# Altium schematic sheet Oxygen-Analyzer.SchDoc
size A3
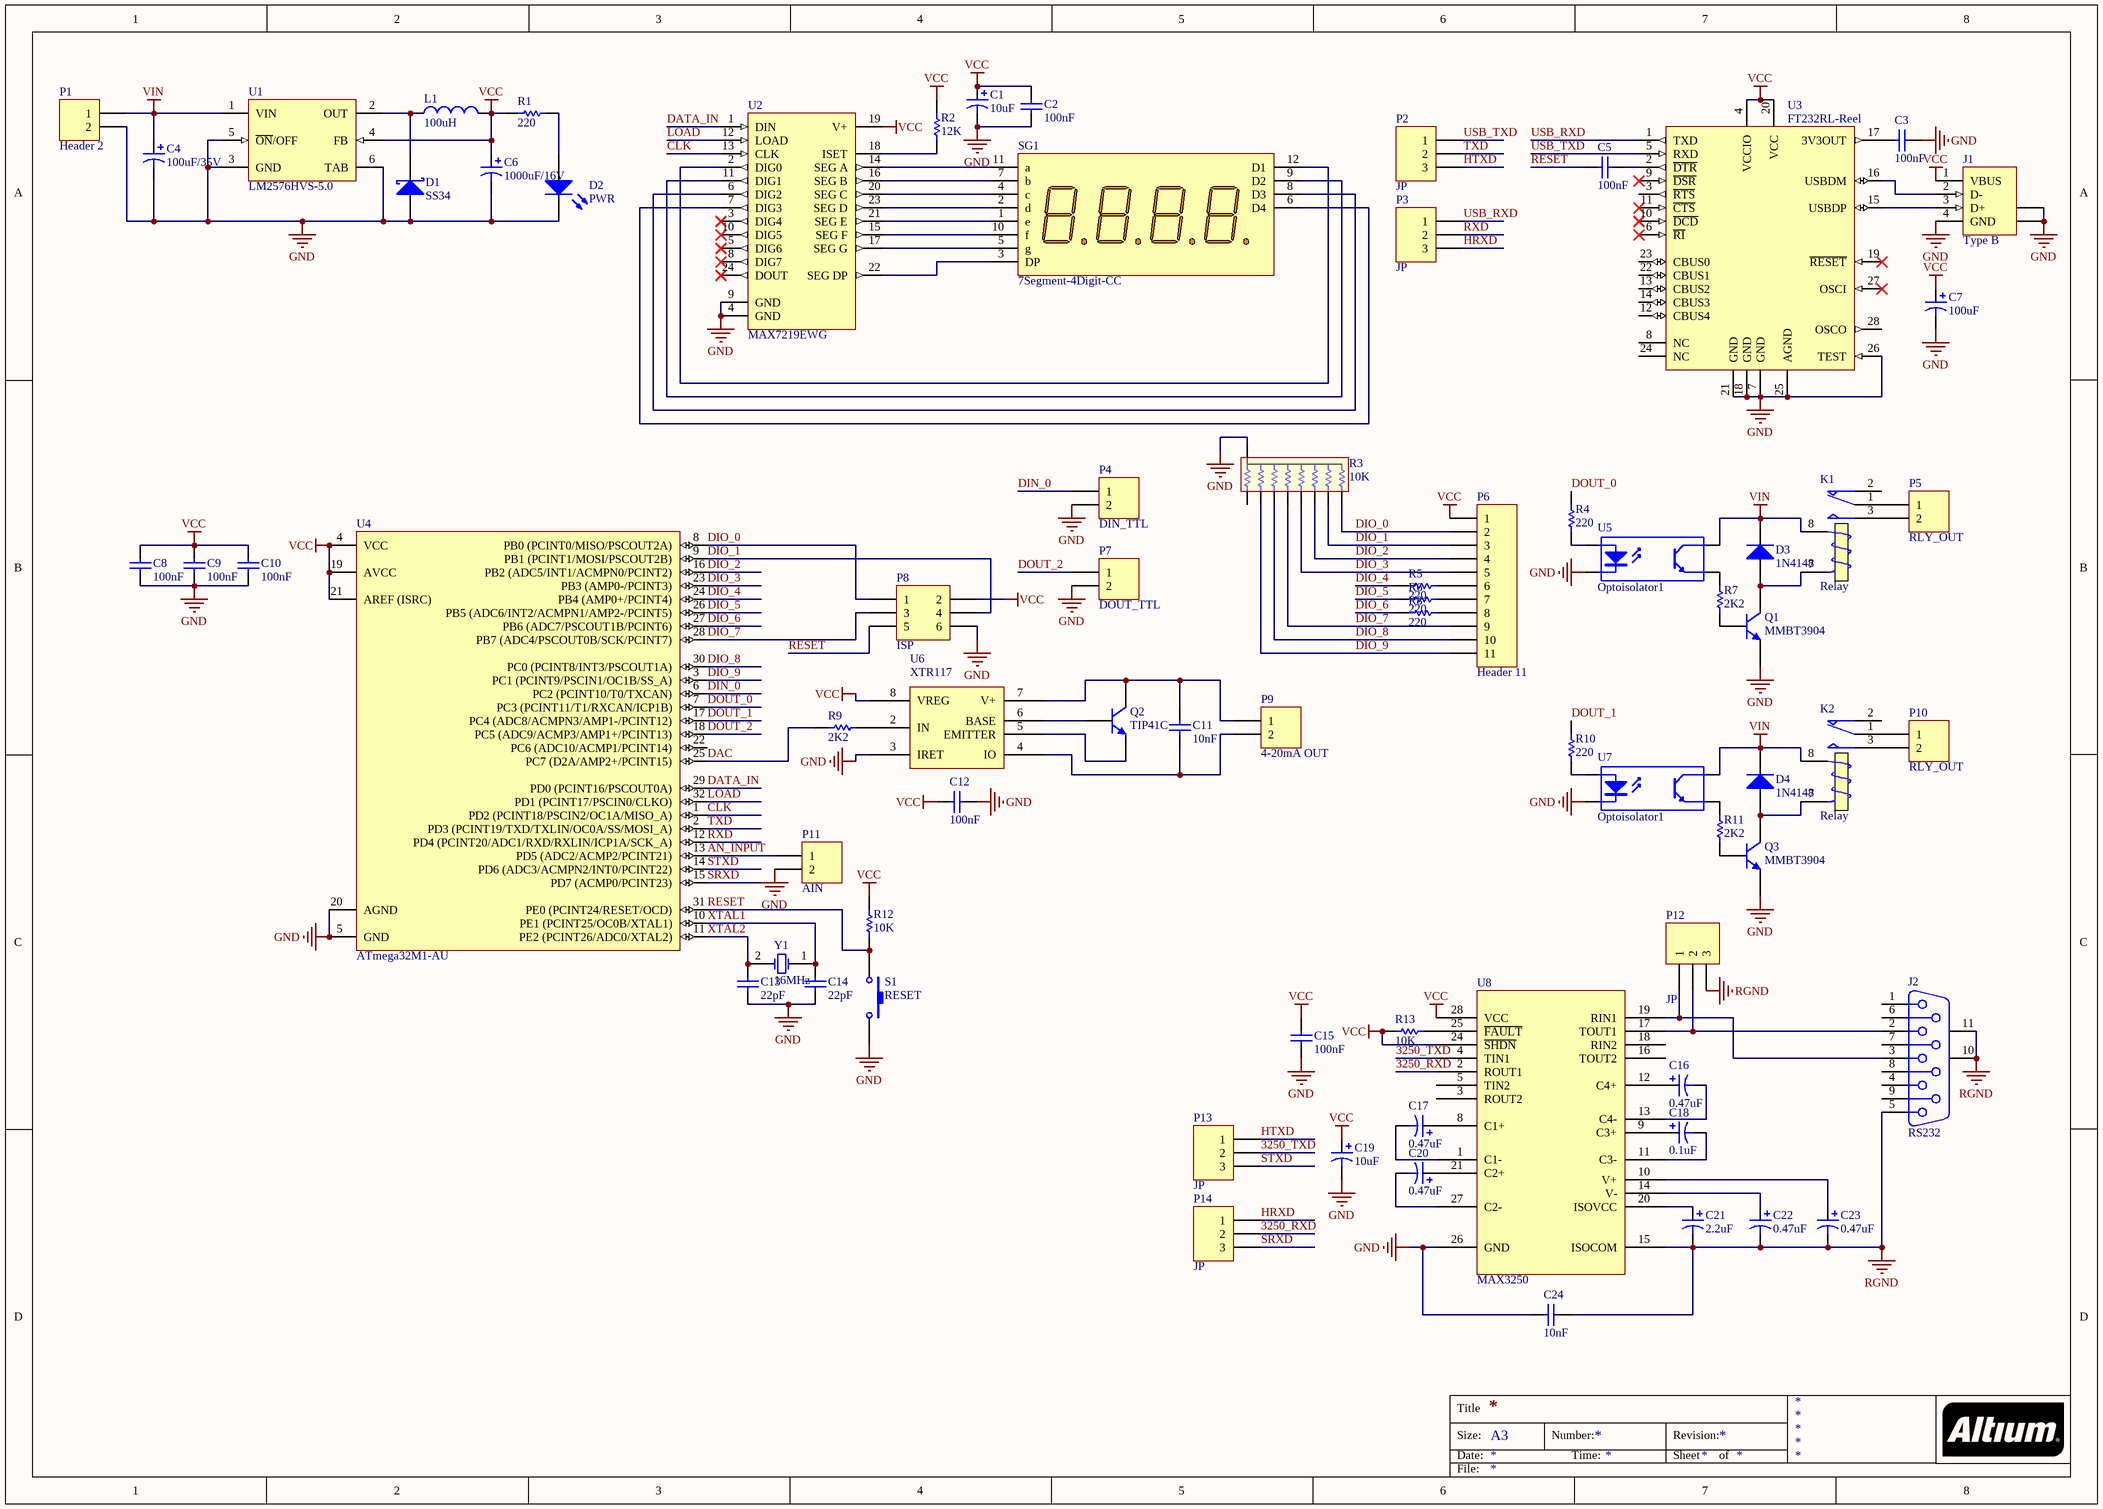
[diagram p0: Oxygen-Analyzer.SchDoc]

## Parts
C1  10uF  [CT3216]
C2  100nF  [C0805]
C3  100nF  [C0805]
C4  100uF/35V  [SMD_ELCO_6MM]
C5  100nF  [C0805]
C6  1000uF/16V  [SMD_ELCO_10MM]
C7  100uF  [CT7343]
C8  100nF  [C0805]
C9  100nF  [C0805]
C10  100nF  [C0805]
C11  10nF  [C0805]
C12  100nF  [C0805]
C13  22pF  [C0805]
C14  22pF  [C0805]
C15  100nF  [C0805]
C16  0.47uF  [CT3216]
C17  0.47uF  [CT3216]
C18  0.1uF  [CT3216]
C19  10uF  [CT3216]
C20  0.47uF  [CT3216]
C21  2.2uF  [CT3216]
C22  0.47uF  [CT3216]
C23  0.47uF  [CT3216]
C24  10nF  [C0805]
D1  SS34  [SMC]
D2  PWR  [CHIPLED_1206]
D3  1N4148  [SOD80C]
D4  1N4148  [SOD80C]
J1  Type B  [USB-B-PTH]
J2  RS232  [DB9_MALE]
K1  Relay  [351]
K2  Relay  [351]
L1  100uH  [DR73]
P1  Header 2  [W237-132]
P2  JP  [HDR1X3]
P3  JP  [HDR1X3]
P4  DIN_TTL  [W237-132]
P5  RLY_OUT  [W237-132]
P6  Header 11  [HDR1X11]
P7  DOUT_TTL  [W237-132]
P8  ISP  [HDR2X3]
P9  4-20mA OUT  [W237-132]
P10  RLY_OUT  [W237-132]
P11  AIN  [W237-132]
P12  JP  [HDR1X3]
P13  JP  [HDR1X3]
P14  JP  [HDR1X3]
Q1  MMBT3904  [SOT23_N]
Q2  TIP41C  [TO220H]
Q3  MMBT3904  [SOT23_N]
R1  220  [R0805]
R2  12K  [R0805]
R3  10K  [SIL9]
R4  220  [R0805]
R5  220  [R0805]
R6  220  [R0805]
R7  2K2  [R0805]
R8  220  [R0805]
R9  2K2  [R0805]
R10  220  [R0805]
R11  2K2  [R0805]
R12  10K  [R0805]
R13  10K  [R0805]
S1  RESET  [TACTILE-SWITCH-1101NE]
SG1  7Segment-4Digit-CC  [7Segment-4Digit-CC]
U1  LM2576HVS-5.0  [TS5B_N]
U2  MAX7219EWG  [WSO24_N]
U3  FT232RL-Reel  [SSOP-28_N]
U4  ATmega32M1-AU  [32A_N]
U5  Optoisolator1  [DIP-4]
U6  XTR117  [MSOP8]
U7  Optoisolator1  [DIP-4]
U8  MAX3250  [SSOP-28]
Y1  16MHz  [HC49US]

## Nets
GND: C1.2 C2.1 C3.1 C4.2 C6.2 C7.2 C8.1 C9.1 C10.1 C12.1 C13.1 C14.1 C15.1 C19.2 C24.2 D1.1(A) D2.2(K) J1.4(GND) J1.5(SHLD) J1.6(SHLD) P1.2 P4.2 P7.2 P8.6 P11.2 Q1.2(E) Q3.2(E) R3.1 S1.2 U1.3(GND) U1.5(~{ON}/OFF) U1.6(TAB) U2.4(GND) U2.9(GND) U3.7(GND) U3.18(GND) U3.21(GND) U3.25(AGND) U3.26(TEST) U4.5(GND) U4.20(AGND) U5.2(K) U6.3(IRET) U7.2(K) U8.26(GND)
RGND: C21.2 C22.2 C23.2 C24.1 J2.5 J2.10(MH1) J2.11(MH2) P12.3 U8.15(ISOCOM)
VCC: C1.1 C2.2 C6.1 C7.1 C8.2 C9.2 C10.2 C12.2 C15.2 C19.1 J1.1(VBUS) L1.2 P6.1 P8.2 R1.2 R2.1 R12.1 R13.1 U1.4(FB) U2.19(V+) U3.4(VCCIO) U3.20(VCC) U4.4(VCC) U4.19(AVCC) U4.21(AREF_(ISRC)) U6.8(VREG) U8.24(~{SHDN}) U8.28(VCC)
VIN: C4.1 D3.2(K) D4.2(K) K1.8(T1) K2.8(T1) P1.1 U1.1(VIN) U5.4(C) U7.4(C)
3250_RXD: P14.2 U8.2(ROUT1)
3250_TXD: P13.2 U8.4(TIN1)
AN_INPUT: P11.1 U4.13(PD5_(ADC2/ACMP2/PCINT21))
CLK: U2.13(CLK) U4.1(PD2_(PCINT18/PSCIN2/OC1A/MISO_A))
DAC: R9.1 U4.25(PC7_(D2A/AMP2+/PCINT15))
DATA_IN: U2.1(DIN) U4.29(PD0_(PCINT16/PSCOUT0A))
DIN_0: P4.1 U4.6(PC2_(PCINT10/T0/TXCAN))
DIO_0: P6.2 P8.1 R3.9 U4.8(PB0_(PCINT0/MISO/PSCOUT2A))
DIO_1: P6.3 P8.4 R3.8 U4.9(PB1_(PCINT1/MOSI/PSCOUT2B))
DIO_2: P6.4 R3.7 U4.16(PB2_(ADC5/INT1/ACMPN0/PCINT2))
DIO_3: P6.5 R3.6 U4.23(PB3_(AMP0-/PCINT3))
DIO_4: R5.1 U4.24(PB4_(AMP0+/PCINT4))
DIO_5: R6.1 U4.26(PB5_(ADC6/INT2/ACMPN1/AMP2-/PCINT5))
DIO_6: R8.1 U4.27(PB6_(ADC7/PSCOUT1B/PCINT6))
DIO_7: P6.9 P8.3 R3.5 U4.28(PB7_(ADC4/PSCOUT0B/SCK/PCINT7))
DIO_8: P6.10 R3.4 U4.30(PC0_(PCINT8/INT3/PSCOUT1A))
DIO_9: P6.11 R3.3 U4.3(PC1_(PCINT9/PSCIN1/OC1B/SS_A))
DOUT_0: R4.1 U4.7(PC3_(PCINT11/T1/RXCAN/ICP1B))
DOUT_1: R10.1 U4.17(PC4_(ADC8/ACMPN3/AMP1-/PCINT12))
DOUT_2: P7.1 U4.18(PC5_(ADC9/ACMP3/AMP1+/PCINT13))
HRXD: P3.3 P14.1
HTXD: P2.3 P13.1
LOAD: U2.12(LOAD) U4.32(PD1_(PCINT17/PSCIN0/CLKO))
RESET: C5.2 P8.5 R12.2 S1.1 U4.31(PE0_(PCINT24/RESET/OCD))
RXD: P3.2 U4.12(PD4_(PCINT20/ADC1/RXD/RXLIN/ICP1A/SCK_A))
SRXD: P14.3 U4.15(PD7_(ACMP0/PCINT23))
STXD: P13.3 U4.14(PD6_(ADC3/ACMPN2/INT0/PCINT22))
TXD: P2.2 U4.2(PD3_(PCINT19/TXD/TXLIN/OC0A/SS/MOSI_A))
USB_RXD: P3.1 U3.1(TXD)
USB_TXD: P2.1 U3.5(RXD)
XTAL1: C14.2 U4.10(PE1_(PCINT25/OC0B/XTAL1)) Y1.1(OSC1)
XTAL2: C13.2 U4.11(PE2_(PCINT26/ADC0/XTAL2)) Y1.2(OSC2)
NetC3_2: C3.2 U3.17(3V3OUT)
NetC5_1: C5.1 U3.2(~{DTR})
NetC11_1: C11.1 P9.2 U6.4(IO)
NetC11_2: C11.2 P9.1 Q2.2(C) U6.7(V+)
NetC16_1: C16.1 U8.12(C4+)
NetC16_2: C16.2 U8.13(C4-)
NetC17_1: C17.1 U8.8(C1+)
NetC17_2: C17.2 U8.1(C1-)
NetC18_1: C18.1 U8.9(C3+)
NetC18_2: C18.2 U8.11(C3-)
NetC20_1: C20.1 U8.21(C2+)
NetC20_2: C20.2 U8.27(C2-)
NetC21_1: C21.1 U8.20(ISOVCC)
NetC22_1: C22.1 U8.14(V-)
NetC23_1: C23.1 U8.10(V+)
NetD1_2: D1.2(K) L1.1 U1.2(OUT)
NetD2_1: D2.1(A) R1.1
NetD3_1: D3.1(A) K1.7(T2) Q1.3(C)
NetD4_1: D4.1(A) K2.7(T2) Q3.3(C)
NetJ1_2: J1.2(D-) U3.16(USBDM)
NetJ1_3: J1.3(D+) U3.15(USBDP)
NetJ2_2: J2.2 P12.2 U8.17(TOUT1)
NetJ2_3: J2.3 P12.1 U8.19(RIN1)
NetK1_1: K1.1(COM) P5.1
NetK1_3: K1.3(NO) P5.2
NetK2_1: K2.1(COM) P10.1
NetK2_3: K2.3(NO) P10.2
NetP6_6: P6.6 R5.2
NetP6_7: P6.7 R6.2
NetP6_8: P6.8 R8.2
NetQ1_1: Q1.1(B) R7.2
NetQ2_1: Q2.1(B) U6.6(BASE)
NetQ2_3: Q2.3(E) U6.5(EMITTER)
NetQ3_1: Q3.1(B) R11.2
NetR2_2: R2.2 U2.18(ISET)
NetR4_2: R4.2 U5.1(A)
NetR7_1: R7.1 U5.3(E)
NetR9_2: R9.2 U6.2(IN)
NetR10_2: R10.2 U7.1(A)
NetR11_1: R11.1 U7.3(E)
NetR13_2: R13.2 U8.25(~{FAULT})
NetSG1_1: SG1.1(e) U2.21(SEG_E)
NetSG1_2: SG1.2(d) U2.23(SEG_D)
NetSG1_3: SG1.3(DP) U2.22(SEG_DP)
NetSG1_4: SG1.4(c) U2.20(SEG_C)
NetSG1_5: SG1.5(g) U2.17(SEG_G)
NetSG1_6: SG1.6(D4) U2.7(DIG3)
NetSG1_7: SG1.7(b) U2.16(SEG_B)
NetSG1_8: SG1.8(D3) U2.6(DIG2)
NetSG1_9: SG1.9(D2) U2.11(DIG1)
NetSG1_10: SG1.10(f) U2.15(SEG_F)
NetSG1_11: SG1.11(a) U2.14(SEG_A)
NetSG1_12: SG1.12(D1) U2.2(DIG0)

Not connected (* = marked no-connect by the designer): J2 1 4 6 7 8 9; K1 2(NC); K2 2(NC); R3 2; U2 3(DIG4)* 5(DIG6)* 8(DIG7)* 10(DIG5)* 24(DOUT)*; U3 3(~{RTS}) 6(~{RI})* 8(NC) 9(~{DSR})* 10(~{DCD})* 11(~{CTS})* 12(CBUS4) 13(CBUS2) 14(CBUS3) 19(~{RESET})* 22(CBUS1) 23(CBUS0) 24(NC) 27(OSCI)* 28(OSCO); U4 22(PC6_(ADC10/ACMP1/PCINT14)); U8 3(ROUT2) 5(TIN2) 16(TOUT2) 18(RIN2)

## Notes on the sheet
- Title
- Size:
- Date:
- A3
- Number:
- Time:
- Revision:
- Sheet
- of
- File:

## Library data of the parts
C1 C4 C6 C7 C16-C23 = Cap Pol1: Polarized Capacitor (Radial); Published: 8-Jun-2000; LatestRevisionDate: 17-Jul-2002; LatestRevisionNote: Re-released for DXP Platform.; PackageReference: RB7.6-15; Publisher: Altium Limited; PackageDescription: Polarized Capacitor (Radial); 2 Leads
  C1 C19: Value: 10uF
  C4: Value: 100uF/35V
  C6: Value: 1000uF/16V
  C7: Value: 100uF
  C16 C17 C20 C22 C23: Value: 0.47uF
  C18: Value: 0.1uF
  C21: Value: 2.2uF
C2 C3 C5 C8-C15 C24 = Cap: Capacitor; Published: 8-Jun-2000; LatestRevisionDate: 17-Jul-2002; LatestRevisionNote: Re-released for DXP Platform.; PackageReference: RAD-0.3; Publisher: Altium Limited; PackageDescription: Radial Cap, Thru-Hole; 2 Leads; 0.3 in Pin Spacing
  C2 C3 C5 C8-C10 C12 C15: Value: 100nF
  C11 C24: Value: 10nF
  C13 C14: Value: 22pF
D1 = D Schottky: Schottky Diode; Published: 8-Jun-2000; LatestRevisionDate: 17-Jul-2002; LatestRevisionNote: Re-released for DXP Platform.; PackageReference: SMB; Publisher: Altium Limited; PackageDescription: DO-214-AA/SMB; 2 C-Bend Leads; Body 5.3 x 3.6 mm, inc. leads (LxW); Code_JEDEC: DO-214-AA
D2 = LED0: Typical INFRARED GaAs LED; Published: 8-Jun-2000; LatestRevisionDate: 08-Jul-2005; LatestRevisionNote: Mech Layer 1 removed.; PackageReference: LED-0; Publisher: Altium Limited; PackageDescription: LED; 2 Leads
D3 D4 = Diode: Default Diode; Published: 8-Jun-2000; LatestRevisionDate: 17-Jul-2002; LatestRevisionNote: Re-released for DXP Platform.; PackageVersion: Sep-1996; PackageReference: SMC; Publisher: Altium Limited; PackageDescription: DO-214-AB/SMC; 2 C-Bend Leads; Body 7.9 x 5.9 mm, inc. leads (LxW); Code_JEDEC: DO-214-AB
J1 = USB: Value: Type B; Category: Connector; Type: USB; Price: 2250; Link: http://www.sfe-electronics.com/product.php?category=12&product_id=156
J2 = D Connector 9: Receptacle Assembly, 9 Position, Right Angle; PackageDocument: O; Positions: 9; Published: 15-Jun-2001; LatestRevisionDate: 17-Jul-2002; LatestRevisionNote: Re-released for DXP Platform.; DatasheetDocument: 1-Sep-1999; PackageReference: 788750; Publisher: Altium Limited; Orientation: Right Angle; Gender: Receptacle
K1 K2 = Relay: SPDT Relay; Published: 8-Jun-2000; LatestRevisionDate: 17-Jul-2002; LatestRevisionNote: Re-released for DXP Platform.; PackageReference: MODULE5B; Publisher: Altium Limited
L1 = Inductor: Code_IEC: 1005; Published: 8-Jun-2000; LatestRevisionDate: 29-May-2009; LatestRevisionNote: IPC-7351 Footprint Added.; PackageReference: 0402-A; Publisher: Altium Limited; PackageDescription: Chip Inductor; Code_JEITA: 0402; Value: 100uH
P1 P4 P5 P7 P9-P11 = Header 2: Header, 2-Pin; LatestRevisionDate: 17-Jul-2002; LatestRevisionNote: Re-released for DXP Platform.; Publisher: Altium Limited
P2 P3 P12-P14 = Header 3: Header, 3-Pin; LatestRevisionDate: 17-Jul-2002; LatestRevisionNote: Re-released for DXP Platform.; Publisher: Altium Limited
P6 = Header 11: Header, 11-Pin; LatestRevisionDate: 17-Jul-2002; LatestRevisionNote: Re-released for DXP Platform.; Publisher: Altium Limited
P8 = Header 3X2: Header, 3-Pin, Dual row; LatestRevisionDate: 17-Jul-2002; LatestRevisionNote: Re-released for DXP Platform.; Publisher: Altium Limited
Q1-Q3 = NPN: NPN Bipolar Transistor; Published: 8-Jun-2000; LatestRevisionDate: 17-Jul-2002; LatestRevisionNote: Re-released for DXP Platform.; PackageReference: TO-226-AA; Publisher: Altium Limited; PackageDescription: TO, Flat Index; 3 In-Line, Axial Leads; Body Dia. 4.8mm; Leads 0.55 x 0.51 mm (max); Code_JEDEC: TO-226-AA
R1 R2 R4-R13 = Res1: Resistor; Published: 8-Jun-2000; LatestRevisionDate: 17-Jul-2002; LatestRevisionNote: Re-released for DXP Platform.; PackageReference: AXIAL-0.3; Publisher: Altium Limited; PackageDescription: Axial Device, Thru-Hole; 2 Leads; 0.3 in Pin Spacing
  R1 R4-R6 R8 R10: Value: 220
  R2: Value: 12K
  R7 R9 R11: Value: 2K2
  R12 R13: Value: 10K
R3 = Resistor Pack
S1 = SW-PB: Switch; Published: 24-Mar-1999; LatestRevisionDate: 17-Jul-2002; LatestRevisionNote: Re-released for DXP Platform.; PackageReference: SPST-2; Publisher: Altium Limited; PackageDescription: Switch; 2 Leads
U1 = LM2576HVS-5.0: SIMPLE SWITCHER® 3A Step-Down Voltage Regulator, 5-pin TO-263; Manufacturer: National Semiconductor; PackageTopMarking: NSUZXYTTE#*LM2576*HVS-5.0 P+; PowerWise: N; Published: 4-Dec-2008; DatasheetVersion: Aug-2004; PackageVersion: revD, Apr-2005; PackageReference: TS5B; Publisher: Altium Limited; PackageDescription: TO-263, Molded, .400 x .390 x .180in, 5 Lead, .067in Pitch, Surface Mount; PartNumber: LM2576HVS-5.0; RoHS: N; PinCount: 5; CompType: Switcher; Code_JEDEC: MO-169-AB; ComponentLink1Description: LM2576HV Datasheet; ComponentLink1URL: http://www.national.com/ds/LM/LM2576HV.pdf; ComponentLink2Description: LM2576HV Web Page; ComponentLink2URL: http://www.national.com/pf/LM/LM2576HV.html; ComponentLink3Description: TS5B Package Page; ComponentLink3URL: http://www.national.com/packaging/folders/ts5b.html
U2 = MAX7219EWG: Serially Interfaced, 8-Digit LED Display Driver; Published: 16-Jan-2001; LatestRevisionDate: 13-Apr-2006; LatestRevisionNote: IPC-7351 Footprint Added.; DatasheetVersion: Jul-1997; PackageReference: WSO24; Publisher: Altium Limited; PackageDescription: 24-Pin Small Outline Integrated Circuit 1.27 mm Pitch; ComponentLink1Description: Manufacturer Link; ComponentLink1URL: http://www.maxim-ic.com/; ComponentLink2Description: Datasheet; ComponentLink2URL: http://pdfserv.maxim-ic.com/en/ds/MAX7219-MAX7221.pdf
U3 = FT232RL-Reel: USB UART Asynchronous Serial Data Transfer Chip, SSOP-28, Tape and Reel; Published: 19-Aug-2010; DatasheetVersion: ver 2.07, Jul-2010; PackageVersion: 2010; PackageReference: SSOP-28; Publisher: Altium Limited; PackageDescription: 28-Pin Small Outline Package 0.65 mm Pitch; ComponentLink1Description: Manufacturer Link; ComponentLink1URL: http://www.ftdichip.com/Products/ICs/FT232R.htm; ComponentLink2Description: Datasheet; ComponentLink2URL: http://www.ftdichip.com/Support/Documents/DataSheets/ICs/DS_FT232R.pdf
U4 = ATmega32M1-AU: 8-bit AVR Microcontroller, 32KB Flash, 1KB EEPROM, 2KB SRAM, Industrial Grade (-40° to +85°C), 32-Pin TQFP; Published: 1-Apr-2010; DatasheetVersion: revB, Oct-2009; PackageVersion: revB, Oct-2001; PackageReference: 32A; Publisher: Altium Limited; PackageDescription: 32-Lead, 7x7x1.0 mm Body, 0.8mm Lead Pitch, Thin Profile Plastic Quad Flat Package (TQFP); Supplier 1: Digi-Key; Supplier Part Number 1: ATMEGA32M1-AU-ND; Supplier 2: Mouser; Supplier Part Number 2: 556-ATMEGA32M1-AU; Code_JEDEC: MS-026-ABA; ComponentLink1Description: Manufacturer Link; ComponentLink1URL: http://www.atmel.com/products/avr/default.asp?; ComponentLink2Description: ATmega16M1/32M1/64M1 Datasheet; ComponentLink2URL: http://www.atmel.com/dyn/resources/prod_documents/doc8209.pdf; ComponentLink3Description: ATmega16M1/32M1/64M1 Summary; ComponentLink3URL: http://www.atmel.com/dyn/resources/prod_documents/8209S.pdf; ComponentLink4Description: Atmel.com Home; ComponentLink4URL: http://www.atmel.com
U5 U7 = Optoisolator1: 4-Pin Phototransistor Optocoupler; Published: 24-Mar-1999; LatestRevisionDate: 04-Mar-2005; LatestRevisionNote: Sch pins 3 & 4 Swapped.; DatasheetVersion: Nov-2003; PackageReference: DIP-4; Publisher: Altium Limited
Y1 = XTAL: Crystal Oscillator; Published: 8-Jun-2000; LatestRevisionDate: 17-Jul-2002; LatestRevisionNote: Re-released for DXP Platform.; PackageReference: R38; Publisher: Altium Limited; PackageDescription: Crystal, Thru-Hole; 2 Leads; Body 3.1 x 8.2 mm (Dia.xH)